# Altium project PCB_Project.PrjPcb
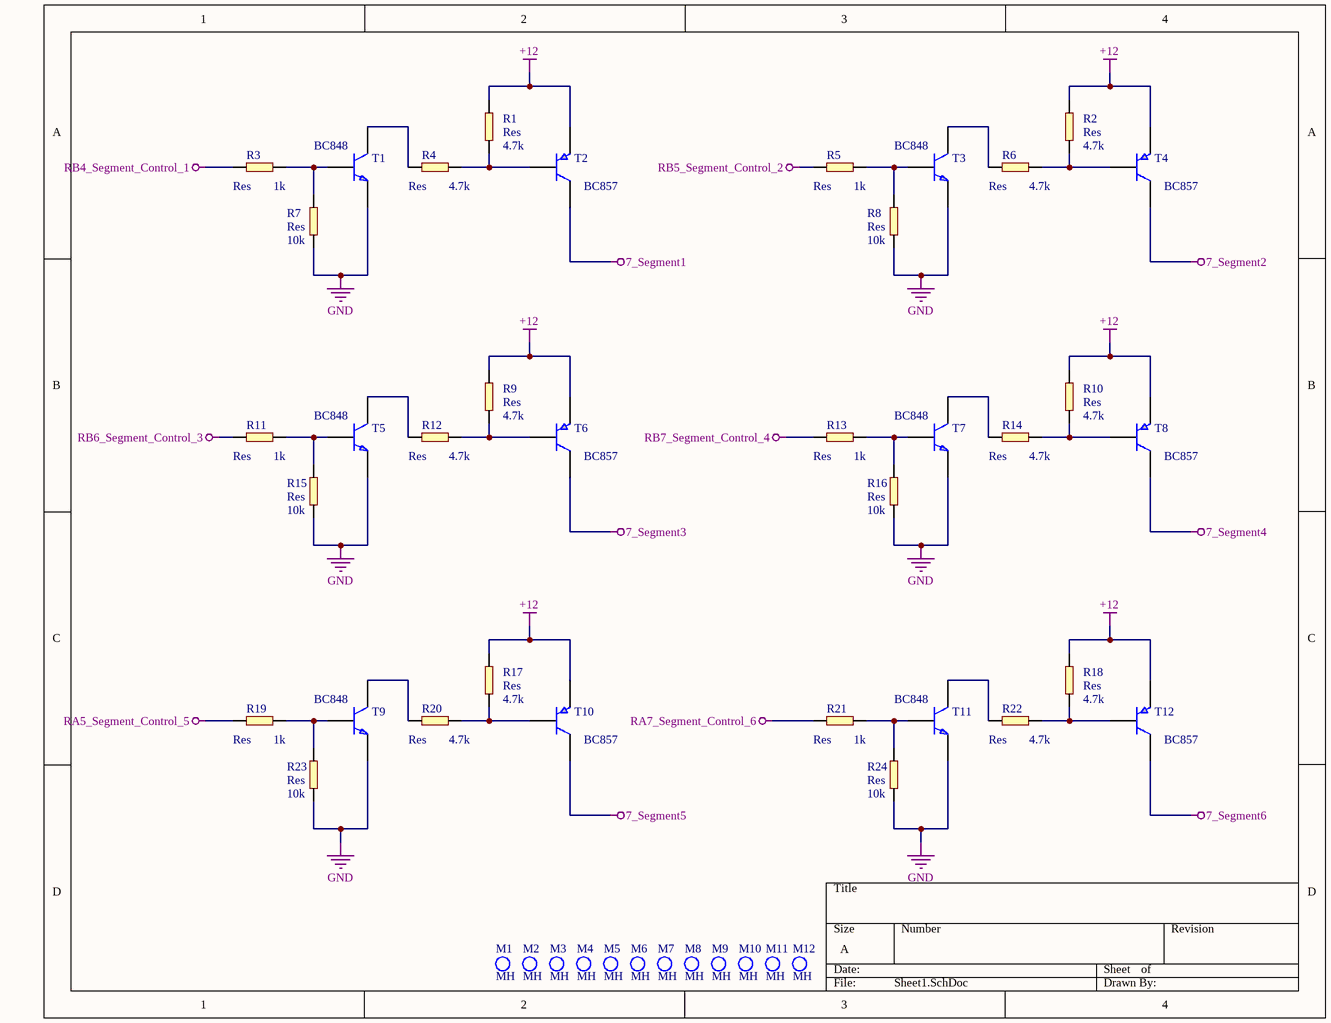
[diagram p0: Sheet1.SchDoc]
6 sheets, 171 parts. Net scope: global (net labels, ports and power ports of the same name join across sheets).
Board file: PCB1.PcbDoc
Sheets:
  Sheet1.SchDoc
  Sheet2.SchDoc
  Sheet3.SchDoc
  Sheet4.SchDoc
  Sheet5.SchDoc
  Sheet6.SchDoc

## Sheet Sheet1.SchDoc
size A

### Parts
M1  MH  [Mounting hole]
M2  MH  [Mounting hole]
M3  MH  [Mounting hole]
M4  MH  [Mounting hole]
M5  MH  [Mounting hole]
M6  MH  [Mounting hole]
M7  MH  [Mounting hole]
M8  MH  [Mounting hole]
M9  MH  [Mounting hole]
M10  MH  [Mounting hole]
M11  MH  [Mounting hole]
M12  MH  [Mounting hole]
R1  Res  value 4.7k  [RES0805]
R2  Res  value 4.7k  [RES0805]
R3  Res  value 1k  [RES0805]
R4  Res  value 4.7k  [RES0805]
R5  Res  value 1k  [RES0805]
R6  Res  value 4.7k  [RES0805]
R7  Res  value 10k  [RES0805]
R8  Res  value 10k  [RES0805]
R9  Res  value 4.7k  [RES0805]
R10  Res  value 4.7k  [RES0805]
R11  Res  value 1k  [RES0805]
R12  Res  value 4.7k  [RES0805]
R13  Res  value 1k  [RES0805]
R14  Res  value 4.7k  [RES0805]
R15  Res  value 10k  [RES0805]
R16  Res  value 10k  [RES0805]
R17  Res  value 4.7k  [RES0805]
R18  Res  value 4.7k  [RES0805]
R19  Res  value 1k  [RES0805]
R20  Res  value 4.7k  [RES0805]
R21  Res  value 1k  [RES0805]
R22  Res  value 4.7k  [RES0805]
R23  Res  value 10k  [RES0805]
R24  Res  value 10k  [RES0805]
T1  BC848  [SOT23]
T2  BC857  [SOT23]
T3  BC848  [SOT23]
T4  BC857  [SOT23]
T5  BC848  [SOT23]
T6  BC857  [SOT23]
T7  BC848  [SOT23]
T8  BC857  [SOT23]
T9  BC848  [SOT23]
T10  BC857  [SOT23]
T11  BC848  [SOT23]
T12  BC857  [SOT23]

### Nets
7_Segment1: T2.3(C)
7_Segment2: T4.3(C)
7_Segment3: T6.3(C)
7_Segment4: T8.3(C)
7_Segment5: T10.3(C)
7_Segment6: T12.3(C)
+12: R1.2(b) R2.2(b) R9.2(b) R10.2(b) R17.2(b) R18.2(b) T2.2(E) T4.2(E) T6.2(E) T8.2(E) T10.2(E) T12.2(E)
GND: R7.2(b) R8.2(b) R15.2(b) R16.2(b) R23.2(b) R24.2(b) T1.2(E) T3.2(E) T5.2(E) T7.2(E) T9.2(E) T11.2(E)
RA5_Segment_Control_5: R19.2(b)
RA7_Segment_Control_6: R21.2(b)
RB4_Segment_Control_1: R3.2(b)
RB5_Segment_Control_2: R5.2(b)
RB6_Segment_Control_3: R11.2(b)
RB7_Segment_Control_4: R13.2(b)
NetR1_1: R1.1(a) R4.1(a) T2.1(B)
NetR2_1: R2.1(a) R6.1(a) T4.1(B)
NetR3_1: R3.1(a) R7.1(a) T1.1(B)
NetR4_2: R4.2(b) T1.3(C)
NetR5_1: R5.1(a) R8.1(a) T3.1(B)
NetR6_2: R6.2(b) T3.3(C)
NetR9_1: R9.1(a) R12.1(a) T6.1(B)
NetR10_1: R10.1(a) R14.1(a) T8.1(B)
NetR11_1: R11.1(a) R15.1(a) T5.1(B)
NetR12_2: R12.2(b) T5.3(C)
NetR13_1: R13.1(a) R16.1(a) T7.1(B)
NetR14_2: R14.2(b) T7.3(C)
NetR17_1: R17.1(a) R20.1(a) T10.1(B)
NetR18_1: R18.1(a) R22.1(a) T12.1(B)
NetR19_1: R19.1(a) R23.1(a) T9.1(B)
NetR20_2: R20.2(b) T9.3(C)
NetR21_1: R21.1(a) R24.1(a) T11.1(B)
NetR22_2: R22.2(b) T11.3(C)

### Library data of the parts
R1-R24 = Resistor: Res0805
T1 T3 T5 T7 T9 T11 = BC848: TRANSISTOR

## Sheet Sheet2.SchDoc
size A
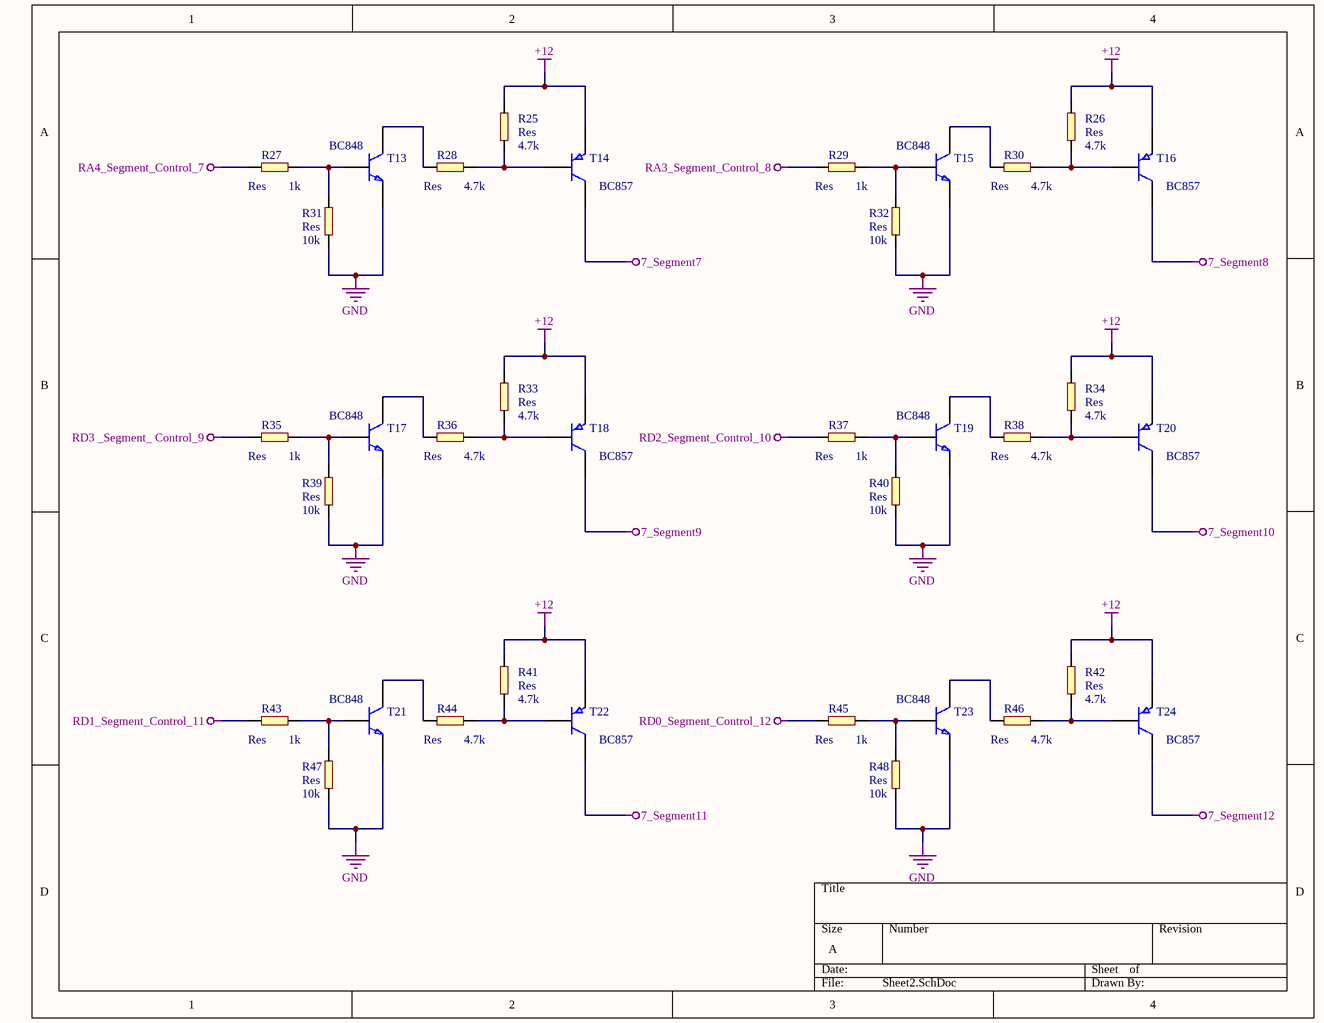
[diagram p1: Sheet2.SchDoc]

### Parts
R25  Res  value 4.7k  [RES0805]
R26  Res  value 4.7k  [RES0805]
R27  Res  value 1k  [RES0805]
R28  Res  value 4.7k  [RES0805]
R29  Res  value 1k  [RES0805]
R30  Res  value 4.7k  [RES0805]
R31  Res  value 10k  [RES0805]
R32  Res  value 10k  [RES0805]
R33  Res  value 4.7k  [RES0805]
R34  Res  value 4.7k  [RES0805]
R35  Res  value 1k  [RES0805]
R36  Res  value 4.7k  [RES0805]
R37  Res  value 1k  [RES0805]
R38  Res  value 4.7k  [RES0805]
R39  Res  value 10k  [RES0805]
R40  Res  value 10k  [RES0805]
R41  Res  value 4.7k  [RES0805]
R42  Res  value 4.7k  [RES0805]
R43  Res  value 1k  [RES0805]
R44  Res  value 4.7k  [RES0805]
R45  Res  value 1k  [RES0805]
R46  Res  value 4.7k  [RES0805]
R47  Res  value 10k  [RES0805]
R48  Res  value 10k  [RES0805]
T13  BC848  [SOT23]
T14  BC857  [SOT23]
T15  BC848  [SOT23]
T16  BC857  [SOT23]
T17  BC848  [SOT23]
T18  BC857  [SOT23]
T19  BC848  [SOT23]
T20  BC857  [SOT23]
T21  BC848  [SOT23]
T22  BC857  [SOT23]
T23  BC848  [SOT23]
T24  BC857  [SOT23]

### Nets
7_Segment7: T14.3(C)
7_Segment8: T16.3(C)
7_Segment9: T18.3(C)
7_Segment10: T20.3(C)
7_Segment11: T22.3(C)
7_Segment12: T24.3(C)
+12: R25.2(b) R26.2(b) R33.2(b) R34.2(b) R41.2(b) R42.2(b) T14.2(E) T16.2(E) T18.2(E) T20.2(E) T22.2(E) T24.2(E)
GND: R31.2(b) R32.2(b) R39.2(b) R40.2(b) R47.2(b) R48.2(b) T13.2(E) T15.2(E) T17.2(E) T19.2(E) T21.2(E) T23.2(E)
RA3_Segment_Control_8: R29.2(b)
RA4_Segment_Control_7: R27.2(b)
RD0_Segment_Control_12: R45.2(b)
RD1_Segment_Control_11: R43.2(b)
RD2_Segment_Control_10: R37.2(b)
RD3 _Segment_ Control_9: R35.2(b)
NetR25_1: R25.1(a) R28.1(a) T14.1(B)
NetR26_1: R26.1(a) R30.1(a) T16.1(B)
NetR27_1: R27.1(a) R31.1(a) T13.1(B)
NetR28_2: R28.2(b) T13.3(C)
NetR29_1: R29.1(a) R32.1(a) T15.1(B)
NetR30_2: R30.2(b) T15.3(C)
NetR33_1: R33.1(a) R36.1(a) T18.1(B)
NetR34_1: R34.1(a) R38.1(a) T20.1(B)
NetR35_1: R35.1(a) R39.1(a) T17.1(B)
NetR36_2: R36.2(b) T17.3(C)
NetR37_1: R37.1(a) R40.1(a) T19.1(B)
NetR38_2: R38.2(b) T19.3(C)
NetR41_1: R41.1(a) R44.1(a) T22.1(B)
NetR42_1: R42.1(a) R46.1(a) T24.1(B)
NetR43_1: R43.1(a) R47.1(a) T21.1(B)
NetR44_2: R44.2(b) T21.3(C)
NetR45_1: R45.1(a) R48.1(a) T23.1(B)
NetR46_2: R46.2(b) T23.3(C)

### Library data of the parts
R25-R48 = Resistor: Res0805
T13 T15 T17 T19 T21 T23 = BC848: TRANSISTOR

## Sheet Sheet3.SchDoc
size A
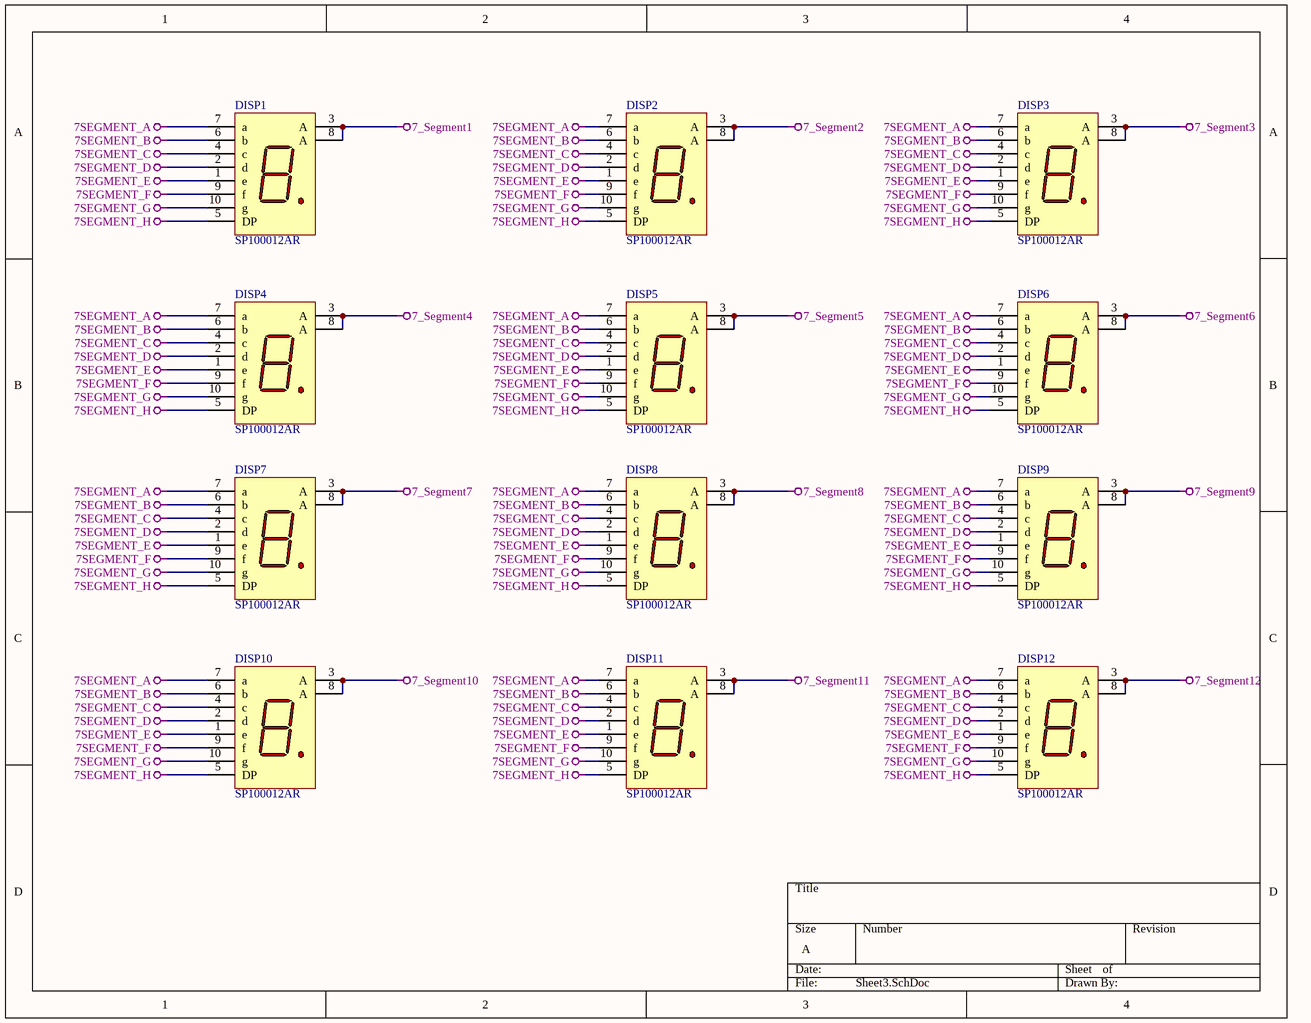
[diagram p2: Sheet3.SchDoc]

### Parts
DISP1  SP100012AR  [SP10012AR-HILIGHT]
DISP2  SP100012AR  [SP10012AR-HILIGHT]
DISP3  SP100012AR  [SP10012AR-HILIGHT]
DISP4  SP100012AR  [SP10012AR-HILIGHT]
DISP5  SP100012AR  [SP10012AR-HILIGHT]
DISP6  SP100012AR  [SP10012AR-HILIGHT]
DISP7  SP100012AR  [SP10012AR-HILIGHT]
DISP8  SP100012AR  [SP10012AR-HILIGHT]
DISP9  SP100012AR  [SP10012AR-HILIGHT]
DISP10  SP100012AR  [SP10012AR-HILIGHT]
DISP11  SP100012AR  [SP10012AR-HILIGHT]
DISP12  SP100012AR  [SP10012AR-HILIGHT]

### Nets
7_Segment1: DISP1.3(A) DISP1.8(A)
7_Segment2: DISP2.3(A) DISP2.8(A)
7_Segment3: DISP3.3(A) DISP3.8(A)
7_Segment4: DISP4.3(A) DISP4.8(A)
7_Segment5: DISP5.3(A) DISP5.8(A)
7_Segment6: DISP6.3(A) DISP6.8(A)
7_Segment7: DISP7.3(A) DISP7.8(A)
7_Segment8: DISP8.3(A) DISP8.8(A)
7_Segment9: DISP9.3(A) DISP9.8(A)
7_Segment10: DISP10.3(A) DISP10.8(A)
7_Segment11: DISP11.3(A) DISP11.8(A)
7_Segment12: DISP12.3(A) DISP12.8(A)
7SEGMENT_A: DISP1.7(a) DISP2.7(a) DISP3.7(a) DISP4.7(a) DISP5.7(a) DISP6.7(a) DISP7.7(a) DISP8.7(a) DISP9.7(a) DISP10.7(a) DISP11.7(a) DISP12.7(a)
7SEGMENT_B: DISP1.6(b) DISP2.6(b) DISP3.6(b) DISP4.6(b) DISP5.6(b) DISP6.6(b) DISP7.6(b) DISP8.6(b) DISP9.6(b) DISP10.6(b) DISP11.6(b) DISP12.6(b)
7SEGMENT_C: DISP1.4(c) DISP2.4(c) DISP3.4(c) DISP4.4(c) DISP5.4(c) DISP6.4(c) DISP7.4(c) DISP8.4(c) DISP9.4(c) DISP10.4(c) DISP11.4(c) DISP12.4(c)
7SEGMENT_D: DISP1.2(d) DISP2.2(d) DISP3.2(d) DISP4.2(d) DISP5.2(d) DISP6.2(d) DISP7.2(d) DISP8.2(d) DISP9.2(d) DISP10.2(d) DISP11.2(d) DISP12.2(d)
7SEGMENT_E: DISP1.1(e) DISP2.1(e) DISP3.1(e) DISP4.1(e) DISP5.1(e) DISP6.1(e) DISP7.1(e) DISP8.1(e) DISP9.1(e) DISP10.1(e) DISP11.1(e) DISP12.1(e)
7SEGMENT_F: DISP1.9(f) DISP2.9(f) DISP3.9(f) DISP4.9(f) DISP5.9(f) DISP6.9(f) DISP7.9(f) DISP8.9(f) DISP9.9(f) DISP10.9(f) DISP11.9(f) DISP12.9(f)
7SEGMENT_G: DISP1.10(g) DISP2.10(g) DISP3.10(g) DISP4.10(g) DISP5.10(g) DISP6.10(g) DISP7.10(g) DISP8.10(g) DISP9.10(g) DISP10.10(g) DISP11.10(g) DISP12.10(g)
7SEGMENT_H: DISP1.5(DP) DISP2.5(DP) DISP3.5(DP) DISP4.5(DP) DISP5.5(DP) DISP6.5(DP) DISP7.5(DP) DISP8.5(DP) DISP9.5(DP) DISP10.5(DP) DISP11.5(DP) DISP12.5(DP)

### Library data of the parts
DISP1-DISP12 = SP100012AR: 34mm/1200mil

## Sheet Sheet4.SchDoc
size A
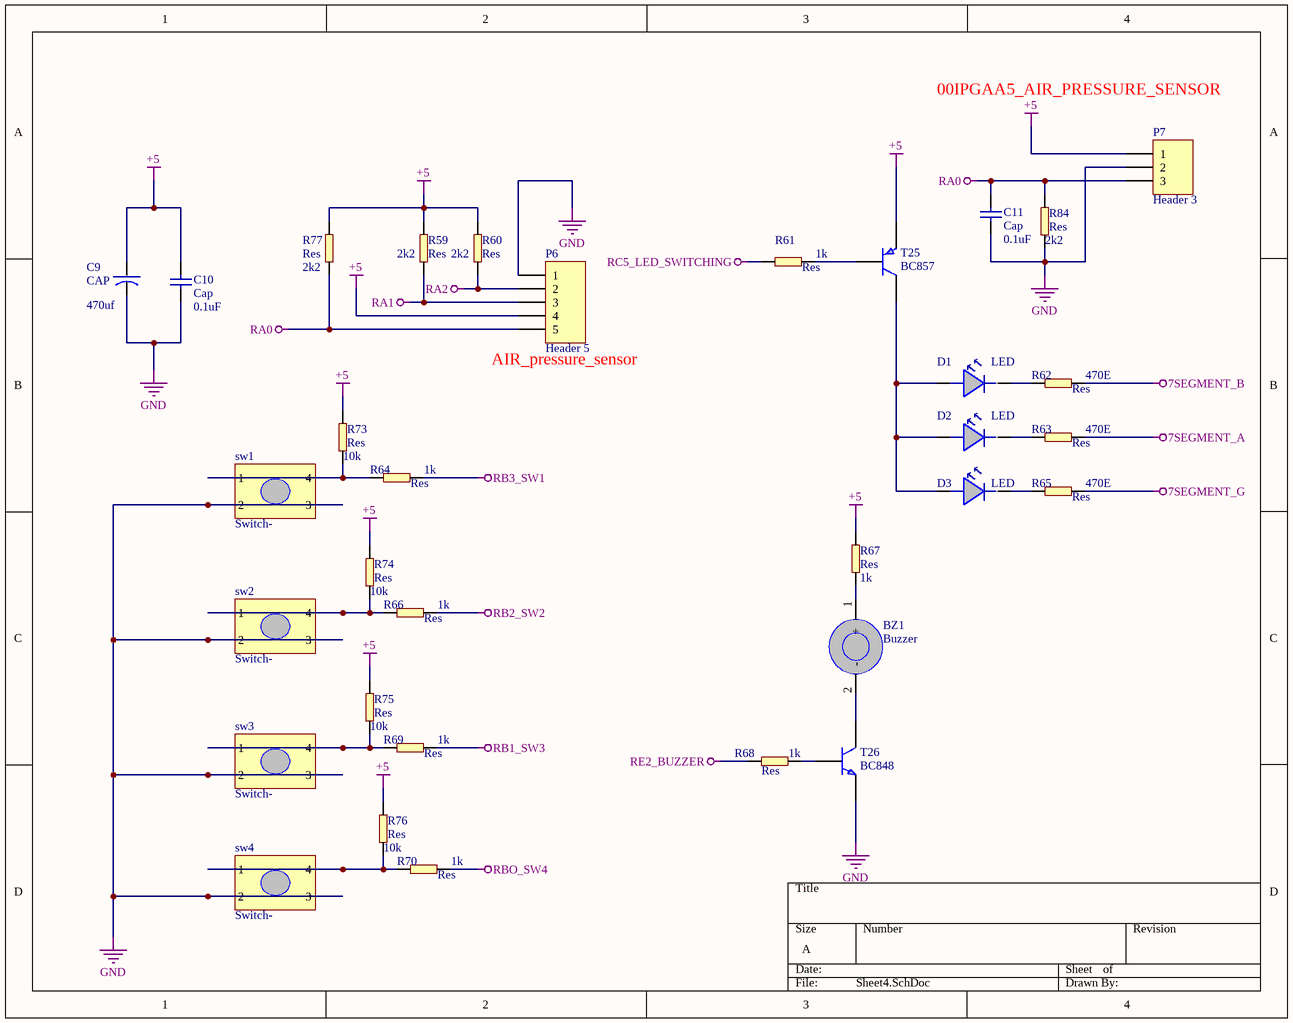
[diagram p3: Sheet4.SchDoc]

### Parts
(Parts that share a designator on the sheet are numbered #1, #2 ... from top to bottom, then left to right.)
BZ1  Buzzer  [Buzze]
C9  CAP  value 470uf  [Capacitor]
C10  Cap  [RES0805]
C11  Cap  [RES0805]
D1  LED  [LED3MM]
D2  LED  [LED3MM]
D3  LED  [LED3MM]
P6  Header 5  [HDR1X5]
P7  Header 3  [HDR1X3]
R59  Res  value 2k2  [RES0805]
R60  Res  value 2k2  [RES0805]
R61#1  Res  value 1k  [RES0805]
R62  Res  value 470E  [RES0805]
R63  Res  value 470E  [RES0805]
R64  Res  value 1k  [RES0805]
R65  Res  value 470E  [RES0805]
R66  Res  value 1k  [RES0805]
R67  Res  value 1k  [RES0805]
R68  Res  value 1k  [RES0805]
R69  Res  value 1k  [RES0805]
R70  Res  value 1k  [RES0805]
R73  Res  value 10k  [RES0805]
R74  Res  value 10k  [RES0805]
R75  Res  value 10k  [RES0805]
R76  Res  value 10k  [RES0805]
R77  Res  value 2k2  [RES0805]
R84  Res  value 2k2  [RES0805]
sw1  Switch-  [switch_200/250]
sw2  Switch-  [switch_200/250]
sw3  Switch-  [switch_200/250]
sw4  Switch-  [switch_200/250]
T25  BC857  [SOT23]
T26  BC848  [SOT23]

### Nets
7SEGMENT_A: R63.2(b)
7SEGMENT_B: R62.2(b)
7SEGMENT_G: R65.2(b)
+5: C9.1(a) C10.1(A) P6.4 P7.1 R59.1(a) R60.1(a) R67.2(b) R73.2(b) R74.2(b) R75.2(b) R76.2(b) R77.2(b) T25.2(E)
GND: C9.2(b) C10.2(A) C11.1(A) P6.1 P7.2 R84.2(b) sw1.2 sw1.3 sw2.2 sw2.3 sw3.2 sw3.3 sw4.2 sw4.3 T26.2(E)
RA0: C11.2(A) P6.5 P7.3 R77.1(a) R84.1(a)
RA1: P6.3 R59.2(b)
RA2: P6.2 R60.2(b)
RB1_SW3: R69.2(b)
RB2_SW2: R66.2(b)
RB3_SW1: R64.2(b)
RBO_SW4: R70.2(b)
RC5_LED_SWITCHING: R61#1.1(a)
RE2_BUZZER: R68.1(a)
NetBZ1_1: BZ1.1(+) R67.1(a)
NetBZ1_2: BZ1.2(-) T26.3(C)
NetD1_1: D1.1(A) D2.1(A) D3.1(A) T25.3(C)
NetD1_2: D1.2(B) R62.1(a)
NetD2_2: D2.2(B) R63.1(a)
NetD3_2: D3.2(B) R65.1(a)
NetR61#1_2: R61#1.2(b) T25.1(B)
NetR64_1: R64.1(a) R73.1(a) sw1.1 sw1.4
NetR66_1: R66.1(a) R74.1(a) sw2.1 sw2.4
NetR68_2: R68.2(b) T26.1(B)
NetR69_1: R69.1(a) R75.1(a) sw3.1 sw3.4
NetR70_1: R70.1(a) R76.1(a) sw4.1 sw4.4

### Notes on the sheet
- 00IPGAA5_AIR_PRESSURE_SENSOR
- (near P6) AIR_pressure_sensor
- (in symbol CAP_104_SMD) 0.1uF

### Library data of the parts
BZ1 = Buzzer_small
C9 = CAP_GT_SMD: 470uf
C10 C11 = CAP_104_SMD
D1-D3 = LED_3MM
P6 = Header 5: Header, 5-Pin; LatestRevisionDate: 17-Jul-2002; LatestRevisionNote: Re-released for DXP Platform.; Publisher: Altium Limited
P7 = Header 3: Header, 3-Pin; LatestRevisionDate: 17-Jul-2002; LatestRevisionNote: Re-released for DXP Platform.; Publisher: Altium Limited
R59 R60 R61#1 R62-R70 R73-R77 R84 = Resistor: Res0805
sw1-sw4 = Switch-: 200/250mil
T26 = BC848: TRANSISTOR

## Sheet Sheet5.SchDoc
size A
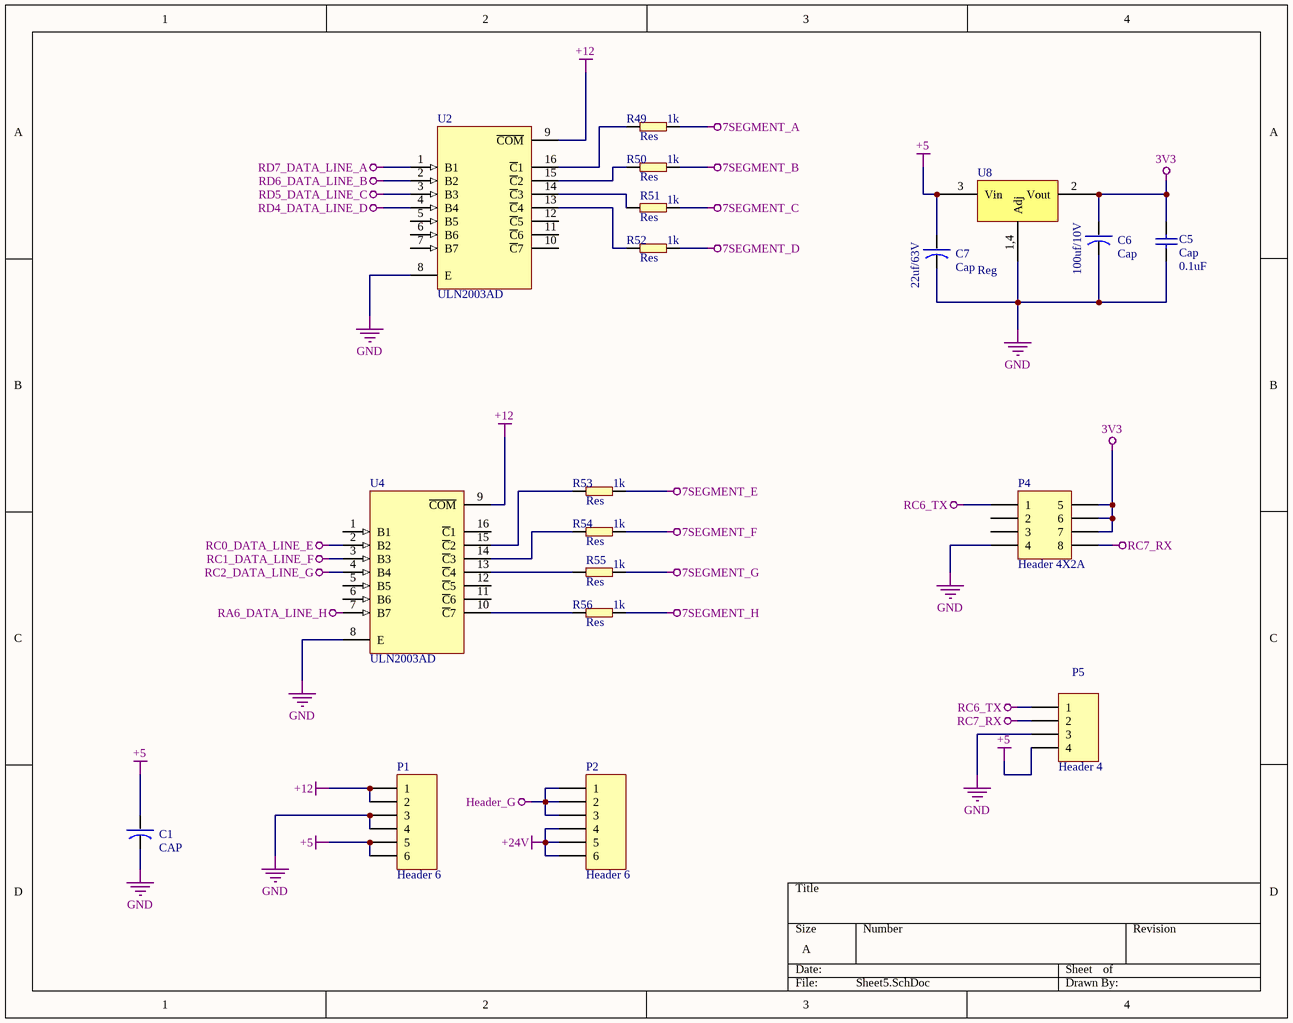
[diagram p4: Sheet5.SchDoc]

### Parts
C1  CAP  [Capacitor]
C5  Cap  [RES0805]
C6  Cap  [CAP_220uF]
C7  Cap  [CAP_220uF]
P1  Header 6  [HDR1X6]
P2  Header 6  [HDR1X6]
P4  Header 4X2A  [HDR2X4_CEN]
P5  Header 4  [HDR1X4]
R49  Res  value 1k  [RES0805]
R50  Res  value 1k  [RES0805]
R51  Res  value 1k  [RES0805]
R52  Res  value 1k  [RES0805]
R53  Res  value 1k  [RES0805]
R54  Res  value 1k  [RES0805]
R55  Res  value 1k  [RES0805]
R56  Res  value 1k  [RES0805]
U2  ULN2003AD  [D016_N]
U4  ULN2003AD  [D016_N]
U8  Reg  [LM1117]

### Nets
3V3: C5.2(A) C6.1(a) P4.5 P4.6 P4.7 U8.2(Vout)
7SEGMENT_A: R49.2(b)
7SEGMENT_B: R50.2(b)
7SEGMENT_C: R51.2(b)
7SEGMENT_D: R52.2(b)
7SEGMENT_E: R53.2(b)
7SEGMENT_F: R54.2(b)
7SEGMENT_G: R55.2(b)
7SEGMENT_H: R56.2(b)
+5: C1.1(a) C7.1(a) P1.5 P1.6 P5.4 U8.3(Vin)
+12: P1.1 P1.2 U2.9(~{COM}) U4.9(~{COM})
+24V: P2.4 P2.5 P2.6
GND: C1.2(b) C5.1(A) C6.2(b) C7.2(b) P1.3 P1.4 P4.4 P5.3 U2.8(E) U4.8(E) U8.1,4(Adj)
Header_G: P2.1 P2.2 P2.3
RA6_DATA_LINE_H: U4.7(B7)
RC0_DATA_LINE_E: U4.2(B2)
RC1_DATA_LINE_F: U4.3(B3)
RC2_DATA_LINE_G: U4.4(B4)
RC6_TX: P4.1 P5.1
RC7_RX: P4.8 P5.2
RD4_DATA_LINE_D: U2.4(B4)
RD5_DATA_LINE_C: U2.3(B3)
RD6_DATA_LINE_B: U2.2(B2)
RD7_DATA_LINE_A: U2.1(B1)
NetR49_1: R49.1(a) U2.16(~{C}1)
NetR50_1: R50.1(a) U2.15(~{C}2)
NetR51_1: R51.1(a) U2.14(~{C}3)
NetR52_1: R52.1(a) U2.13(~{C}4)
NetR53_1: R53.1(a) U4.15(~{C}2)
NetR54_1: R54.1(a) U4.14(~{C}3)
NetR55_1: R55.1(a) U4.13(~{C}4)
NetR56_1: R56.1(a) U4.10(~{C}7)

Not connected (* = marked no-connect by the designer): P4 2 3; U2 5(B5) 6(B6) 7(B7) 10(~{C}7) 11(~{C}6) 12(~{C}5); U4 1(B1) 5(B5) 6(B6) 11(~{C}6) 12(~{C}5) 16(~{C}1)

### Notes on the sheet
- (in symbol CAP_104_SMD) 0.1uF
- (in symbol CAP_220uF) 100uf/10V; 22uf/63V

### Library data of the parts
C1 = CAP_GT_SMD: 470uf
C5 = CAP_104_SMD
C6 C7 = CAP_220uF: Value: 100uf/10v
P1 P2 = Header 6: Header, 6-Pin; LatestRevisionDate: 17-Jul-2002; LatestRevisionNote: Re-released for DXP Platform.; Publisher: Altium Limited
P4 = Header 4X2A: Header, 4-Pin, Dual row; LatestRevisionDate: 17-Jul-2002; LatestRevisionNote: Re-released for DXP Platform.; Publisher: Altium Limited
P5 = Header 4: Header, 4-Pin; LatestRevisionDate: 17-Jul-2002; LatestRevisionNote: Re-released for DXP Platform.; Publisher: Altium Limited
R49-R56 = Resistor: Res0805
U2 U4 = ULN2003AD: Darlington Transistor Array; Published: 15-May-2002; LatestRevisionDate: 13-Apr-2006; LatestRevisionNote: IPC-7351 Footprint Added.; DatasheetVersion: Sep-1986; PackageVersion: Jan-1998; PackageReference: D016; Publisher: Altium Limited; PackageDescription: 16-Pin Small Outline Integrated Circuit 1.27 mm Pitch; Code_IPC: SOIC127P600-16; ComponentLink1Description: Manufacturer Link; ComponentLink1URL: http://www.ti.com/; ComponentLink2Description: Datasheet; ComponentLink2URL: http://www-s.ti.com/sc/ds/uln2002a.pdf
U8 = LM1117

## Sheet Sheet6.SchDoc
size A
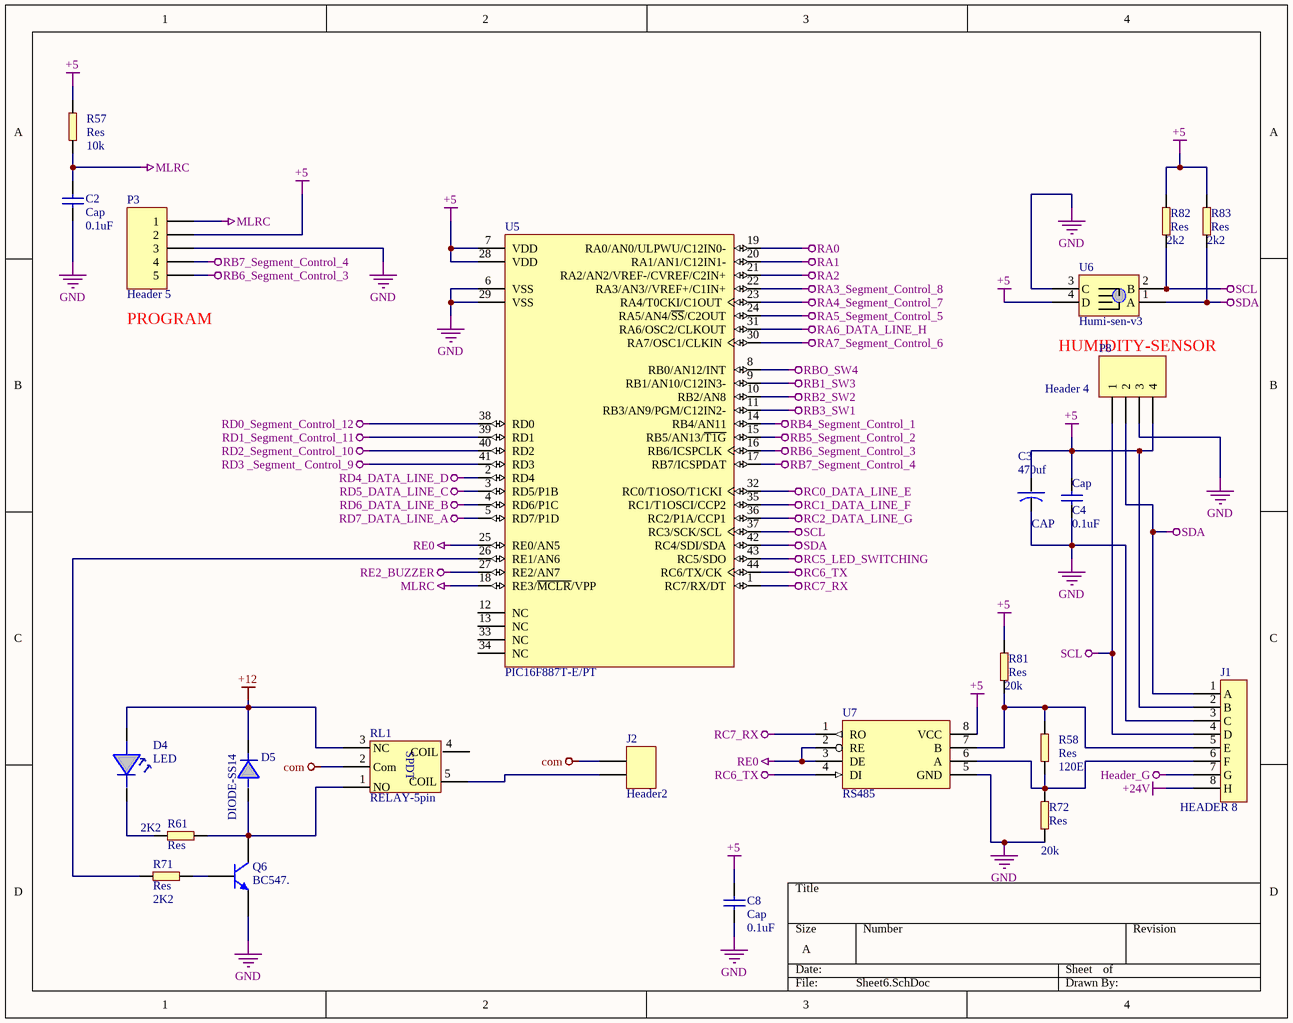
[diagram p5: Sheet6.SchDoc]

### Parts
(Parts that share a designator on the sheet are numbered #1, #2 ... from top to bottom, then left to right.)
C2  Cap  [RES0805]
C3  CAP  value 470uf  [Capacitor]
C4  Cap  [RES0805]
C8  Cap  [RES0805]
D4  LED  [0805_led]
D5  DIODE-SS14  [DO-214AC]
J1  HEADER 8  [HEADER AC]
J2  Header2  [Header2]
P3  Header 5  [HDR1X5]
P8  Header 4  [HDR1X4]
Q6  BC547.  [SOT23_L]
R57  Res  value 10k  [RES0805]
R58  Res  value 120E  [RES0805]
R61#2  Res  value 2K2  [RES0805]
R71  Res  value 2K2  [RES0805]
R72  Res  value 20k  [RES0805]
R81  Res  value 20k  [RES0805]
R82  Res  value 2k2  [RES0805]
R83  Res  value 2k2  [RES0805]
RL1  RELAY-5pin  [RELAY-5pin]
U5  PIC16F887T-E/PT  [TQFP-PT44_N]
U6  Humi-sen-v3  [HUMI-SEN]
U7  RS485  [RS485]

### Nets
+5: C3.1(a) C4.1(A) C8.1(A) J1.2(B) P3.2 P8.4 R57.2(b) R81.1(a) R82.1(a) R83.1(a) U5.7(VDD) U5.28(VDD) U6.4(D) U7.8(VCC)
+12: D4.1(A) D5.2(B) RL1.3(NC)
+24V: J1.8(H)
com: J2.1 RL1.2(Com)
GND: C2.1(A) C3.2(b) C4.2(A) C8.2(A) J1.3(C) P3.3 P8.3 Q6.2(E) R72.1(a) U5.6(VSS) U5.29(VSS) U6.3(C) U7.5(GND)
Header_G: J1.7(G)
MLRC: C2.2(A) P3.1 R57.1(a) U5.18(RE3/~{MCLR}/VPP)
RA0: U5.19(RA0/AN0/ULPWU/C12IN0-)
RA1: U5.20(RA1/AN1/C12IN1-)
RA2: U5.21(RA2/AN2/VREF-/CVREF/C2IN+)
RA3_Segment_Control_8: U5.22(RA3/AN3//VREF+/C1IN+)
RA4_Segment_Control_7: U5.23(RA4/T0CKI/C1OUT)
RA5_Segment_Control_5: U5.24(RA5/AN4/~{SS}/C2OUT)
RA6_DATA_LINE_H: U5.31(RA6/OSC2/CLKOUT)
RA7_Segment_Control_6: U5.30(RA7/OSC1/CLKIN)
RB1_SW3: U5.9(RB1/AN10/C12IN3-)
RB2_SW2: U5.10(RB2/AN8)
RB3_SW1: U5.11(RB3/AN9/PGM/C12IN2-)
RB4_Segment_Control_1: U5.14(RB4/AN11)
RB5_Segment_Control_2: U5.15(RB5/AN13/~{T1G})
RB6_Segment_Control_3: P3.5 U5.16(RB6/ICSPCLK)
RB7_Segment_Control_4: P3.4 U5.17(RB7/ICSPDAT)
RBO_SW4: U5.8(RB0/AN12/INT)
RC0_DATA_LINE_E: U5.32(RC0/T1OSO/T1CKI)
RC1_DATA_LINE_F: U5.35(RC1/T1OSCI/CCP2)
RC2_DATA_LINE_G: U5.36(RC2/P1A/CCP1)
RC5_LED_SWITCHING: U5.43(RC5/SDO)
RC6_TX: U5.44(RC6/TX/CK) U7.4(DI)
RC7_RX: U5.1(RC7/RX/DT) U7.1(RO)
RD0_Segment_Control_12: U5.38(RD0)
RD1_Segment_Control_11: U5.39(RD1)
RD2_Segment_Control_10: U5.40(RD2)
RD3 _Segment_ Control_9: U5.41(RD3)
RD4_DATA_LINE_D: U5.2(RD4)
RD5_DATA_LINE_C: U5.3(RD5/P1B)
RD6_DATA_LINE_B: U5.4(RD6/P1C)
RD7_DATA_LINE_A: U5.5(RD7/P1D)
RE0: U5.25(RE0/AN5) U7.2(RE) U7.3(DE)
RE2_BUZZER: U5.27(RE2/AN7)
SCL: J1.4(D) P8.1 R82.2(b) U5.37(RC3/SCK/SCL) U6.2(B)
SDA: J1.1(A) P8.2 R83.2(b) U5.42(RC4/SDI/SDA) U6.1(A)
NetD4_2: D4.2(B) R61#2.2(b)
NetD5_1: D5.1(A) Q6.3(C) R61#2.1(a) RL1.1(NO)
NetJ1_5: J1.5(E) R58.2(b) R81.2(b) U7.7(B)
NetJ1_6: J1.6(F) R58.1(a) R72.2(b) U7.6(A)
NetJ2_2: J2.2 RL1.5(COIL)
NetQ6_1: Q6.1(B) R71.1(a)
NetR71_2: R71.2(b) U5.26(RE1/AN6)

Not connected (* = marked no-connect by the designer): RL1 4(COIL); U5 12(NC) 13(NC) 33(NC) 34(NC)

### Notes on the sheet
- (near P3) PROGRAM
- HUMIDITY-SENSOR
- (in symbol CAP_104_SMD) 0.1uF
- (in symbol RELAY-5pin) SPDT

### Library data of the parts
C2 C4 C8 = CAP_104_SMD
C3 = CAP_GT_SMD: 470uf
D4 = LED_0805
D5 = DIODE-SS14: SS14
J1 = HEADER 8: AC
P3 = Header 5: Header, 5-Pin; LatestRevisionDate: 17-Jul-2002; LatestRevisionNote: Re-released for DXP Platform.; Publisher: Altium Limited
P8 = Header 4: Header, 4-Pin; LatestRevisionDate: 17-Jul-2002; LatestRevisionNote: Re-released for DXP Platform.; Publisher: Altium Limited
Q6 = BC547.: NPN 1 GHz Wideband Transistor
R57 R58 R61#2 R71 R72 R81-R83 = Resistor: Res0805
U5 = PIC16F887T-E/PT: Flash-Based, 8-Bit CMOS Microcontroller with nanoWatt Technology, 8K (x14-Bit words) Program Memory, 624 Bytes Data Memory, 35 I/O pins, 44-Pin TQFP, Standard VDD Range, Extended Temperature, Tape and Reel; Published: 29-Jan-2009; LatestRevisionDate: 02-Dec-2009; LatestRevisionNote: Updated datasheet to version revF, Apr-2009.; DatasheetVersion: revF, Apr-2009; PackageVersion: revBB, Aug-2009; PackageReference: TQFP-PT44; Publisher: Altium Limited; PackageDescription: 44-Lead Plastic Thin Quad Flatpack (PT) - 10x10x1mm Body, 2.00mm [TQFP]; Code_JEDEC: MS-026; ComponentLink1Description: Datasheet; ComponentLink1URL: http://ww1.microchip.com/downloads/en/DeviceDoc/41291F.pdf; ComponentLink2Description: Packaging Specification; ComponentLink2URL: http://www.microchip.com/stellent/groups/techpub_sg/documents/packagingspec/en012702.pdf; ComponentLink3Description: Microchip.com Home; ComponentLink3URL: http://www.microchip.com/
U7 = RS485: 8-Pin SO

## Nets that join several sheets
7_Segment1: Sheet1 (T2.3), Sheet3 (DISP1.3 DISP1.8)
7_Segment2: Sheet1 (T4.3), Sheet3 (DISP2.3 DISP2.8)
7_Segment3: Sheet1 (T6.3), Sheet3 (DISP3.3 DISP3.8)
7_Segment4: Sheet1 (T8.3), Sheet3 (DISP4.3 DISP4.8)
7_Segment5: Sheet1 (T10.3), Sheet3 (DISP5.3 DISP5.8)
7_Segment6: Sheet1 (T12.3), Sheet3 (DISP6.3 DISP6.8)
7_Segment7: Sheet2 (T14.3), Sheet3 (DISP7.3 DISP7.8)
7_Segment8: Sheet2 (T16.3), Sheet3 (DISP8.3 DISP8.8)
7_Segment9: Sheet2 (T18.3), Sheet3 (DISP9.3 DISP9.8)
7_Segment10: Sheet2 (T20.3), Sheet3 (DISP10.3 DISP10.8)
7_Segment11: Sheet2 (T22.3), Sheet3 (DISP11.3 DISP11.8)
7_Segment12: Sheet2 (T24.3), Sheet3 (DISP12.3 DISP12.8)
7SEGMENT_A: Sheet3 (12 pins), Sheet4 (R63.2), Sheet5 (R49.2)
7SEGMENT_B: Sheet3 (12 pins), Sheet4 (R62.2), Sheet5 (R50.2)
7SEGMENT_C: Sheet3 (12 pins), Sheet5 (R51.2)
7SEGMENT_D: Sheet3 (12 pins), Sheet5 (R52.2)
7SEGMENT_E: Sheet3 (12 pins), Sheet5 (R53.2)
7SEGMENT_F: Sheet3 (12 pins), Sheet5 (R54.2)
7SEGMENT_G: Sheet3 (12 pins), Sheet4 (R65.2), Sheet5 (R55.2)
7SEGMENT_H: Sheet3 (12 pins), Sheet5 (R56.2)
+5: Sheet4 (13 pins), Sheet5 (6 pins), Sheet6 (14 pins)
+12: Sheet1 (12 pins), Sheet2 (12 pins), Sheet5 (P1.1 P1.2 U2.9 U4.9), Sheet6 (D4.1 D5.2 RL1.3)
+24V: Sheet5 (P2.4 P2.5 P2.6), Sheet6 (J1.8)
GND: Sheet1 (12 pins), Sheet2 (12 pins), Sheet4 (15 pins), Sheet5 (11 pins), Sheet6 (13 pins)
Header_G: Sheet5 (P2.1 P2.2 P2.3), Sheet6 (J1.7)
RA0: Sheet4 (5 pins), Sheet6 (U5.19)
RA1: Sheet4 (P6.3 R59.2), Sheet6 (U5.20)
RA2: Sheet4 (P6.2 R60.2), Sheet6 (U5.21)
RA3_Segment_Control_8: Sheet2 (R29.2), Sheet6 (U5.22)
RA4_Segment_Control_7: Sheet2 (R27.2), Sheet6 (U5.23)
RA5_Segment_Control_5: Sheet1 (R19.2), Sheet6 (U5.24)
RA6_DATA_LINE_H: Sheet5 (U4.7), Sheet6 (U5.31)
RA7_Segment_Control_6: Sheet1 (R21.2), Sheet6 (U5.30)
RB1_SW3: Sheet4 (R69.2), Sheet6 (U5.9)
RB2_SW2: Sheet4 (R66.2), Sheet6 (U5.10)
RB3_SW1: Sheet4 (R64.2), Sheet6 (U5.11)
RB4_Segment_Control_1: Sheet1 (R3.2), Sheet6 (U5.14)
RB5_Segment_Control_2: Sheet1 (R5.2), Sheet6 (U5.15)
RB6_Segment_Control_3: Sheet1 (R11.2), Sheet6 (P3.5 U5.16)
RB7_Segment_Control_4: Sheet1 (R13.2), Sheet6 (P3.4 U5.17)
RBO_SW4: Sheet4 (R70.2), Sheet6 (U5.8)
RC0_DATA_LINE_E: Sheet5 (U4.2), Sheet6 (U5.32)
RC1_DATA_LINE_F: Sheet5 (U4.3), Sheet6 (U5.35)
RC2_DATA_LINE_G: Sheet5 (U4.4), Sheet6 (U5.36)
RC5_LED_SWITCHING: Sheet4 (R61#1.1), Sheet6 (U5.43)
RC6_TX: Sheet5 (P4.1 P5.1), Sheet6 (U5.44 U7.4)
RC7_RX: Sheet5 (P4.8 P5.2), Sheet6 (U5.1 U7.1)
RD0_Segment_Control_12: Sheet2 (R45.2), Sheet6 (U5.38)
RD1_Segment_Control_11: Sheet2 (R43.2), Sheet6 (U5.39)
RD2_Segment_Control_10: Sheet2 (R37.2), Sheet6 (U5.40)
RD3 _Segment_ Control_9: Sheet2 (R35.2), Sheet6 (U5.41)
RD4_DATA_LINE_D: Sheet5 (U2.4), Sheet6 (U5.2)
RD5_DATA_LINE_C: Sheet5 (U2.3), Sheet6 (U5.3)
RD6_DATA_LINE_B: Sheet5 (U2.2), Sheet6 (U5.4)
RD7_DATA_LINE_A: Sheet5 (U2.1), Sheet6 (U5.5)
RE2_BUZZER: Sheet4 (R68.1), Sheet6 (U5.27)